# Altium project 通用核心板.PrjPcb
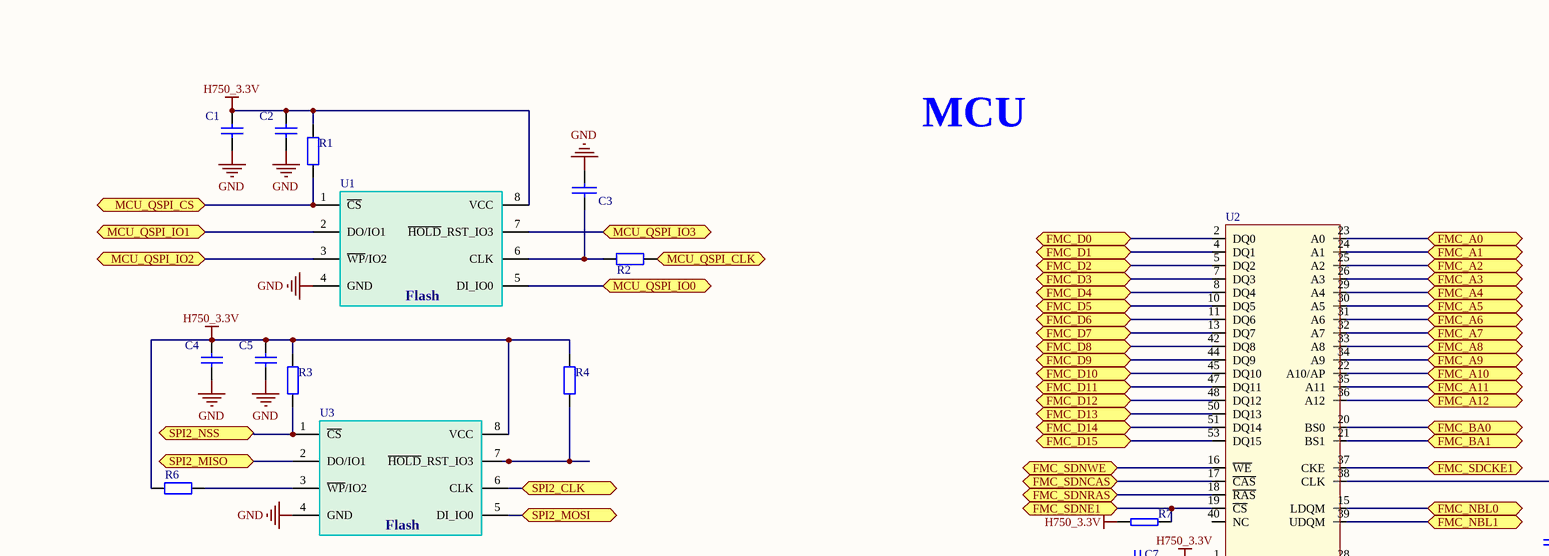
[diagram p0: 通用核心板.SchDoc, top left]
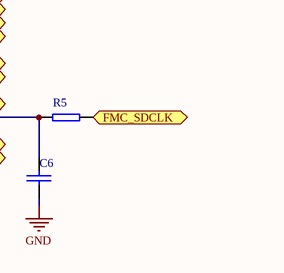
[diagram p1: 通用核心板.SchDoc, top middle]
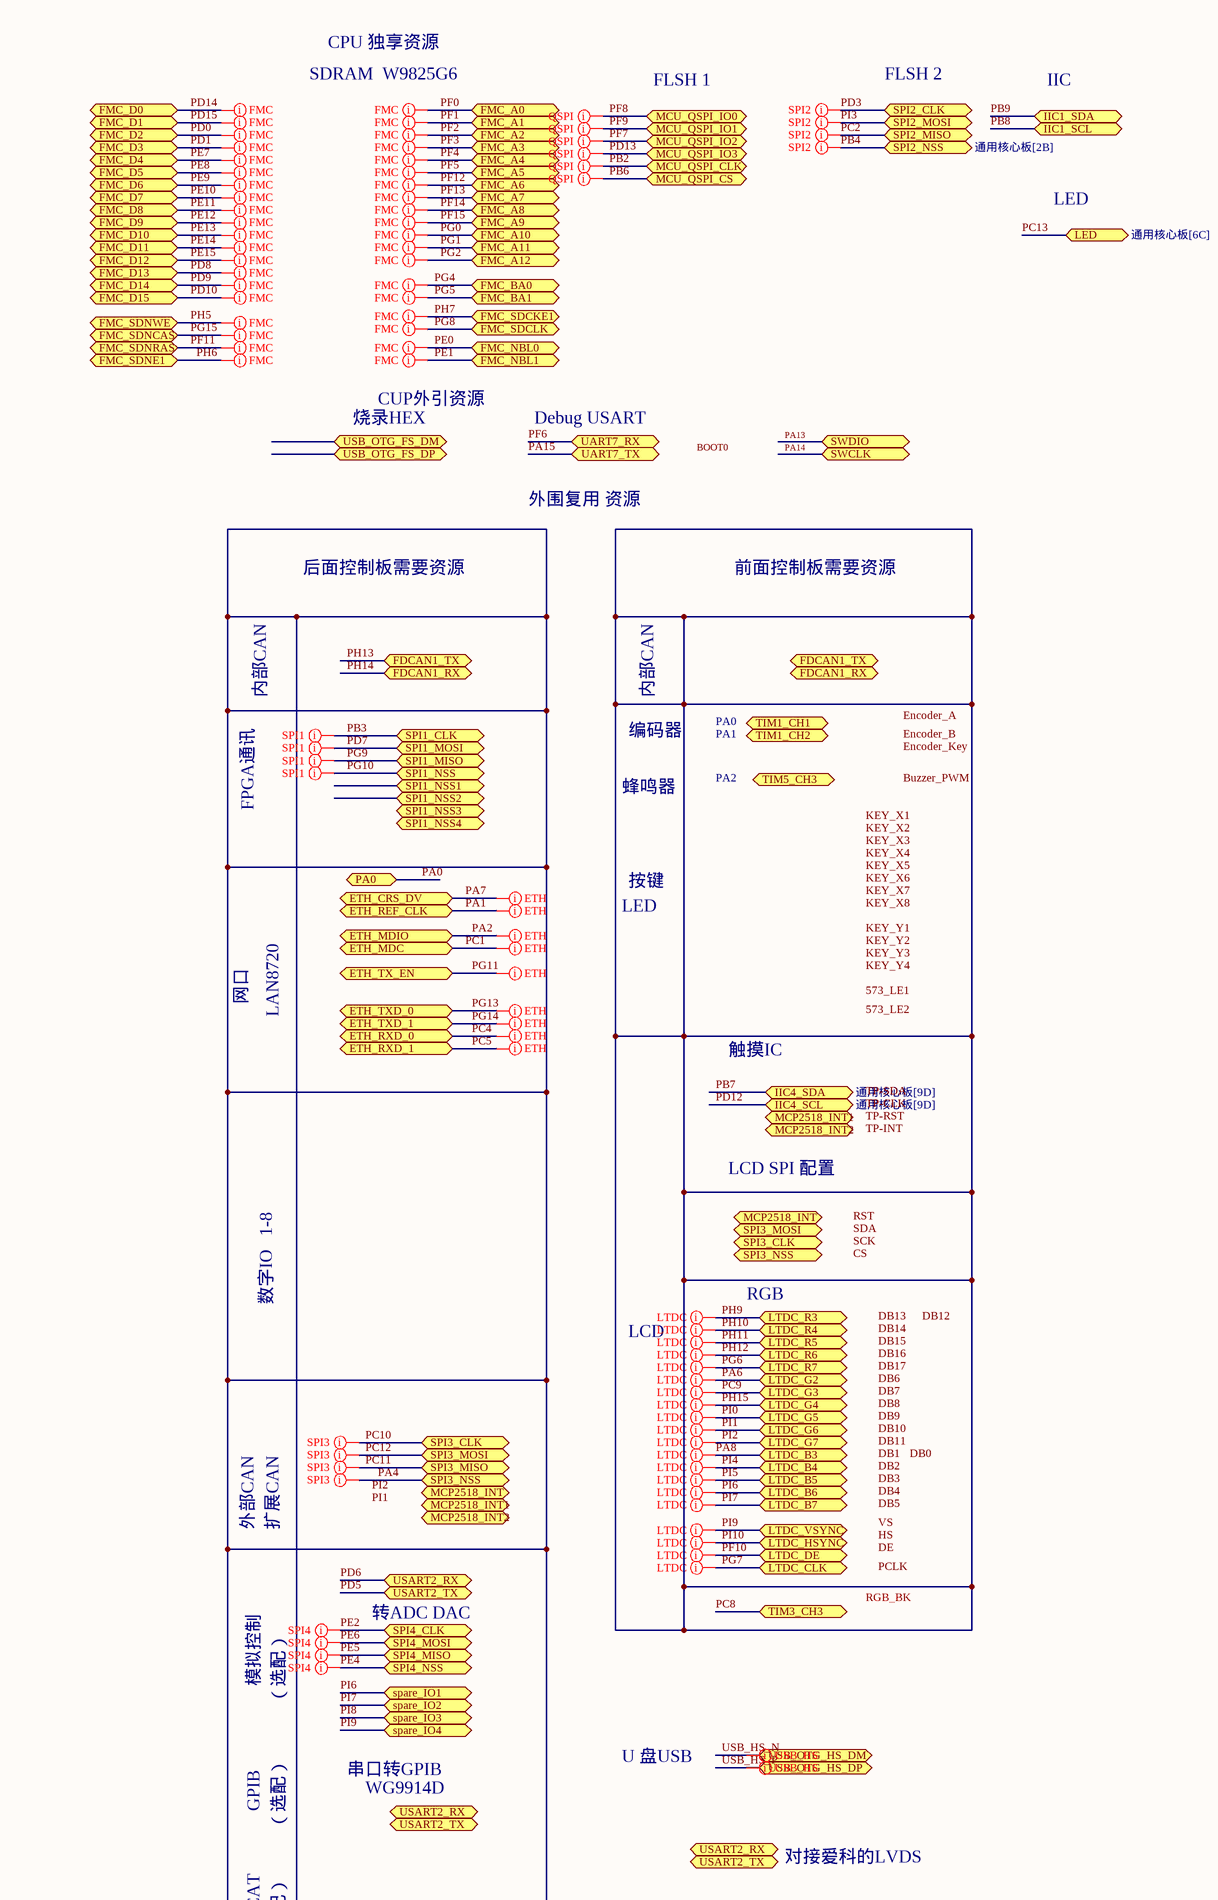
[diagram p2: 通用核心板.SchDoc, top right]
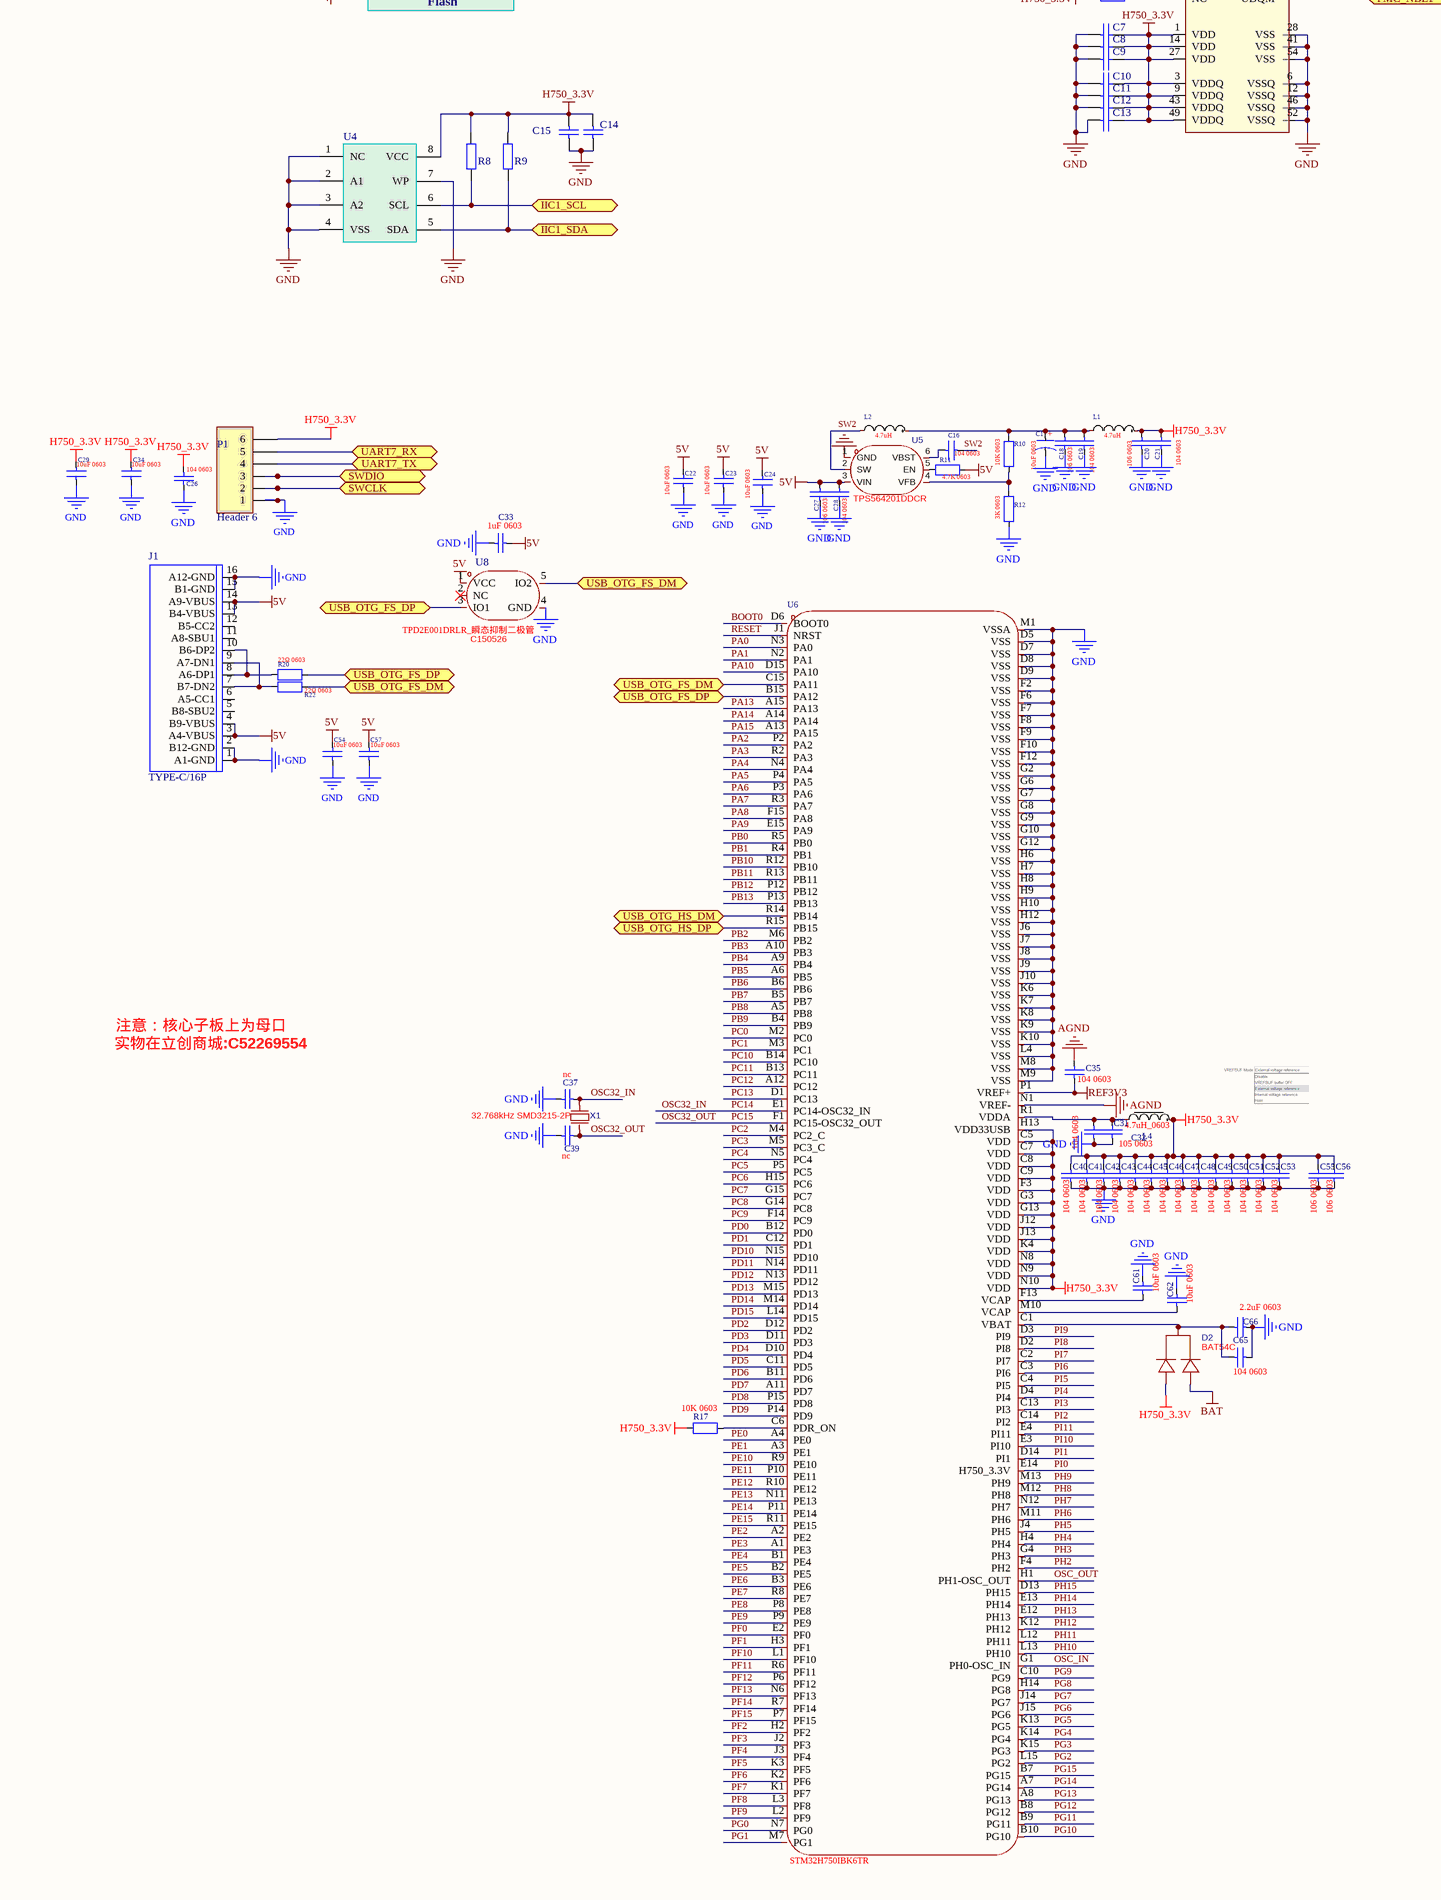
[diagram p3: 通用核心板.SchDoc, bottom left]
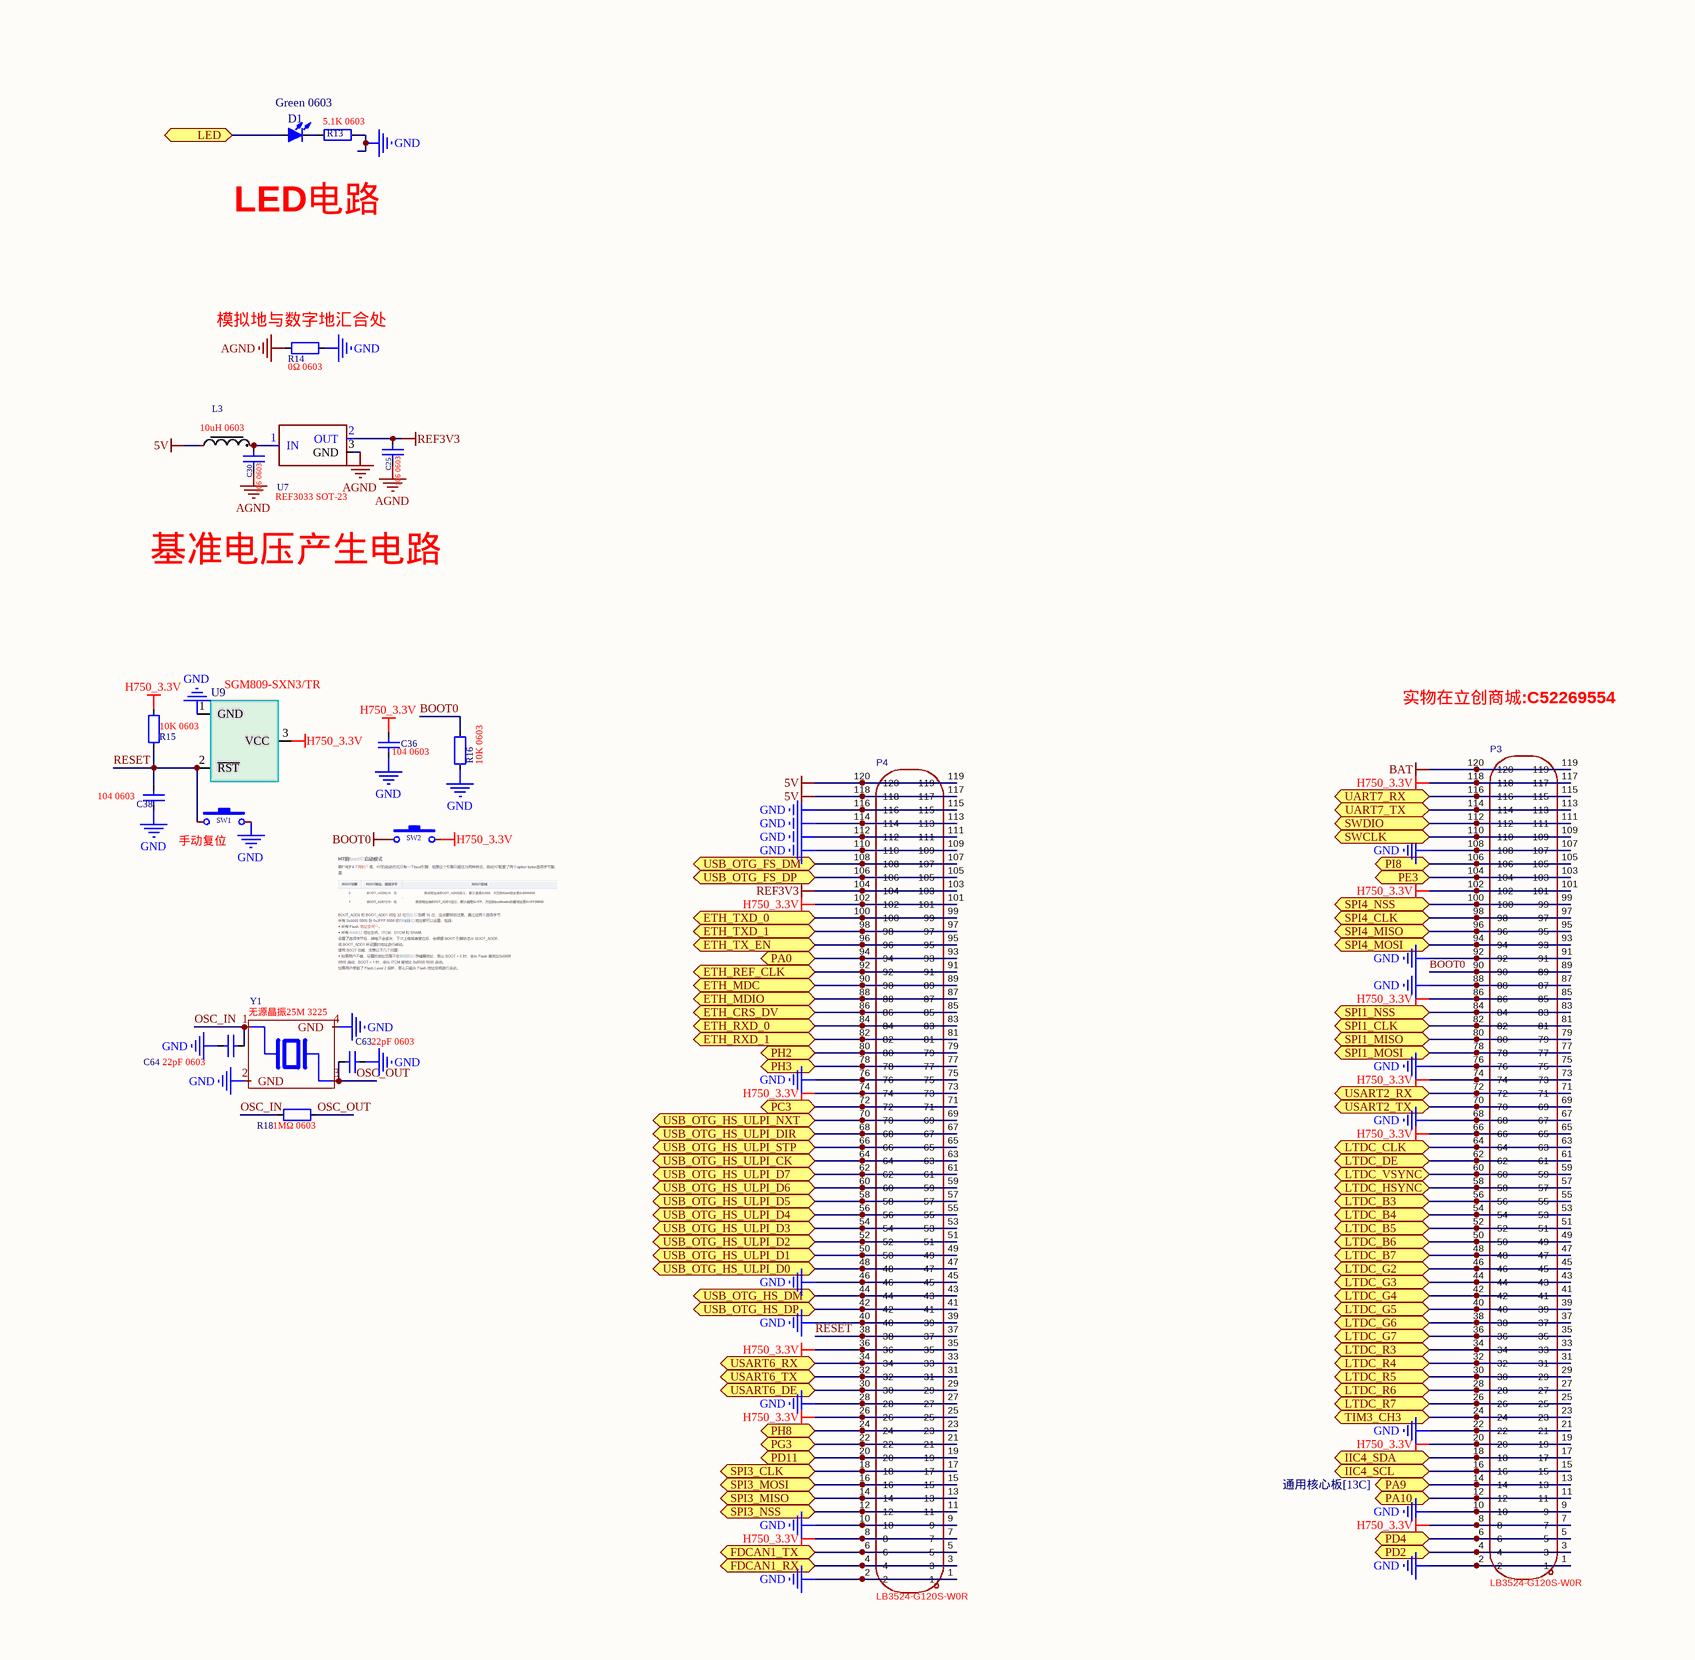
[diagram p4: 通用核心板.SchDoc, bottom middle]
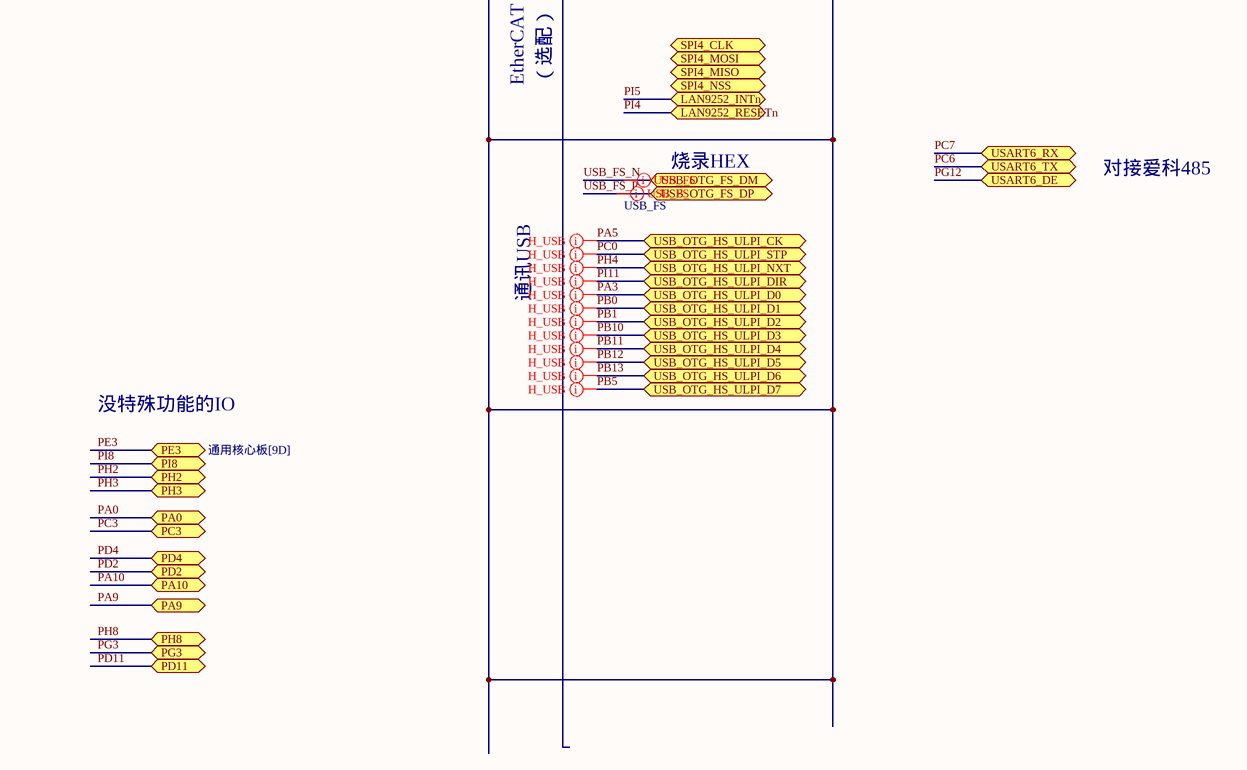
[diagram p5: 通用核心板.SchDoc, bottom right]
1 sheet, 106 parts. Net scope: flat (ports and power ports of the same name join across sheets).
Board file: 通用核心板.PcbDoc

## Sheet 通用核心板.SchDoc
size A0; SheetNumber: 1; SheetTotal: 1

### Parts
C1  贴片独石瓷介电容/106K/±10%/25V/0805/X5R  [C0603]  (value not drawn)
C2  (CZ)贴片电容/贴片/100nF/±5%/50V/0603/X7R/编带  [C0603]  (value not drawn)
C3  18PF/25V  [C0603]  (value not drawn)
C4  贴片独石瓷介电容/106K/±10%/25V/0805/X5R  [C0603]  (value not drawn)
C5  (CZ)贴片电容/贴片/100nF/±5%/50V/0603/X7R/编带  [C0603]  (value not drawn)
C6  NC  [C0603]  (value not drawn)
C7  (CZ)贴片电容/贴片/100nF/±5%/50V/0603/X7R/编带  [C0603]  (value not drawn)
C8  (CZ)贴片电容/贴片/100nF/±5%/50V/0603/X7R/编带  [C0603]  (value not drawn)
C9  (CZ)贴片电容/贴片/100nF/±5%/50V/0603/X7R/编带  [C0603]  (value not drawn)
C10  (CZ)贴片电容/贴片/100nF/±5%/50V/0603/X7R/编带  [C0603]  (value not drawn)
C11  (CZ)贴片电容/贴片/100nF/±5%/50V/0603/X7R/编带  [C0603]  (value not drawn)
C12  (CZ)贴片电容/贴片/100nF/±5%/50V/0603/X7R/编带  [C0603]  (value not drawn)
C13  (CZ)贴片电容/贴片/100nF/±5%/50V/0603/X7R/编带  [C0603]  (value not drawn)
C14  (CZ)贴片电容/贴片/100nF/±5%/50V/0603/X7R/编带  [C0603]  (value not drawn)
C15  贴片独石瓷介电容/106K/±10%/25V/0805/X5R  [C0603]  (value not drawn)
C16  104 0603  [C0603]
C17  10uF 0603  [C0603]
C18  106 0603  [C0603]
C19  104 0603  [C0603]
C20  106 0603  [C0603]
C21  104 0603  [C0603]
C22  10uF 0603  [C0603]
C23  10uF 0603  [C0603]
C24  10uF 0603  [C0603]
C25  106 0603  [C0603]
C26  104 0603  [C0603]
C27  106 0603  [C0603]
C28  104 0603  [C0603]
C29  10uF 0603  [C0603]
C30  106 0603  [C0603]
C31  105 0603  [C0603]
C32  104 0603  [C0603]
C33  1uF 0603  [C0603]
C34  10uF 0603  [C0603]
C35  104 0603  [C0603]
C36  104 0603  [C0603]
C37  nc  [C0603]
C38  104 0603  [C0603]
C39  nc  [C0603]
C40  104 0603  [C0603]
C41  104 0603  [C0603]
C42  104 0603  [C0603]
C43  104 0603  [C0603]
C44  104 0603  [C0603]
C45  104 0603  [C0603]
C46  104 0603  [C0603]
C47  104 0603  [C0603]
C48  104 0603  [C0603]
C49  104 0603  [C0603]
C50  104 0603  [C0603]
C51  104 0603  [C0603]
C52  104 0603  [C0603]
C53  104 0603  [C0603]
C54  10uF 0603  [C0603]
C55  106 0603  [C0603]
C56  106 0603  [C0603]
C57  10uF 0603  [C0603]
C61  10uF 0603  [C0603]
C62  10uF 0603  [C0603]
C63  22pF 0603  [C0603]
C64  22pF 0603  [C0603]
C65  104 0603  [C0603]
C66  2.2uF 0603  [C0603]
D1  Green 0603  [LED_0603]
D2  BAT54C  [BAT54C]
J1  TYPE-C/16P  [TYPE-C/16P]
L1  4.7uH  [L1008]
L2  4.7uH  [L1008]
L3  10uH 0603  [磁珠]
L4  4.7uH_0603  [磁珠]
P1  Header 6  [HDR1X6]
P3  LB3524-G120S-W0R  [LB3524-G120S-W0R]
P4  LB3524-G120S-W0R  [LB3524-G120S-W0R]
R1  贴片电阻Chip Res. 0603 4.7KΩ 1/10W 士1%(RoHS)  [R0603]  (value not drawn)
R2  贴片电阻Chip Res.0603 33Ω  1/16W 土1% 旧编码11279109(RoHS)  [R0603]  (value not drawn)
R3  贴片电阻Chip Res. 0603 4.7KΩ 1/10W 士1%(RoHS)  [R0603]  (value not drawn)
R4  贴片电阻Chip Res. 0603 4.7KΩ 1/10W 士1%(RoHS)  [R0603]  (value not drawn)
R5  33R  [R0603]  (value not drawn)
R6  贴片电阻Chip Res. 0603 4.7KΩ 1/10W 士1%(RoHS)  [R0603]  (value not drawn)
R7  贴片电阻Chip Res. 0603 5.1KΩ 1/10W 士1% 旧编码11277020(RoHS)  [R0603]  (value not drawn)
R8  贴片电阻Chip Res. 0603 2.2KΩ  1/10W 士1% 旧编码11277019(RoHS)  [R0603]  (value not drawn)
R9  贴片电阻Chip Res. 0603 2.2KΩ  1/10W 士1% 旧编码11277019(RoHS)  [R0603]  (value not drawn)
R10  10K 0603  [R0603]
R11  4.7K 0603  [R0603]
R12  3K 0603  [R0603]
R13  5.1K 0603  [R0603]
R14  0Ω 0603  [R0603]
R15  10K 0603  [R0603]
R16  10K 0603  [R0603]
R17  10K 0603  [R0603]
R18  1MΩ 0603  [R0603]
R20  22Ω 0603  [R0603]
R22  22Ω 0603  [R0603]
SW1  SW-PB  [轻触侧按键]  (value not drawn)
SW2  SW-PB  [轻触侧按键]  (value not drawn)
U1  (CD)IC FPGA配置芯片 W25Q64JVSSIQ 封装 SO-8 208mil "Winbond"牌(RoHS)  [MLP-8]  (value not drawn)
U2  (CD)IC/贴片/同步动态随机存取器SDRAM/W9825G6KH-6/TSOPII-54/"Winbond"牌/4M*4banks*16bits  [TSOP-54(L=400MIL)]  (value not drawn)
U3  (CD)IC FPGA配置芯片 W25Q64JVSSIQ 封装 SO-8 208mil "Winbond"牌(RoHS)  [MLP-8]  (value not drawn)
U4  (CD)IC/贴片/铁电存储器/FM24CL64B-GTR/SOIC-8/CYPRESS  [SOP-8]  (value not drawn)
U5  TPS564201DDCR  [TPS564201DDCR]
U6  STM32H750IBK6TR  [STM32H750IBK6TR]
U7  REF3033 SOT-23  [3030]
U8  TPD2E001DRLR_瞬态抑制二极管  [TPD2E001DRLR_瞬态抑制二极管]
U9  SGM809-SXN3/TR  [SGM809-SXN3/TR]
X1  32.768kHz SMD3215-2P  [32.768KHz]
Y1  无源晶振25M 3225  [25M_3225]

### Ports
ETH_CRS_DV (bidir, see 通用核心板[8D]), ETH_CRS_DV (bidir, see 通用核心板[14A]), ETH_MDC (bidir, see 通用核心板[8D]), ETH_MDC (bidir, see 通用核心板[14B]), ETH_MDIO (bidir, see 通用核心板[8D]), ETH_MDIO (bidir, see 通用核心板[14B]), ETH_REF_CLK (bidir, see 通用核心板[8D]), ETH_REF_CLK (bidir, see 通用核心板[14A]), ETH_RXD_0 (bidir, see 通用核心板[8D]), ETH_RXD_0 (bidir, see 通用核心板[14B]), ETH_RXD_1 (bidir, see 通用核心板[8D]), ETH_RXD_1 (bidir, see 通用核心板[14B]), ETH_TX_EN (bidir, see 通用核心板[8D]), ETH_TX_EN (bidir, see 通用核心板[14B]), ETH_TXD_0 (bidir, see 通用核心板[8D]), ETH_TXD_0 (bidir, see 通用核心板[14B]), ETH_TXD_1 (bidir, see 通用核心板[8D]), ETH_TXD_1 (bidir, see 通用核心板[14B]), FDCAN1_RX (bidir, see 通用核心板[8D], 通用核心板[14A]), FDCAN1_RX (bidir, see 通用核心板[8D], 通用核心板[15A]), FDCAN1_RX (bidir, see 通用核心板[14A], 通用核心板[15A]), FDCAN1_TX (bidir, see 通用核心板[8D], 通用核心板[14A]), FDCAN1_TX (bidir, see 通用核心板[8D], 通用核心板[15A]), FDCAN1_TX (bidir, see 通用核心板[14A], 通用核心板[15A]), FMC_A0 (bidir, see 通用核心板[5B]), FMC_A0 (bidir, see 通用核心板[14A]), FMC_A1 (bidir, see 通用核心板[5B]), FMC_A1 (bidir, see 通用核心板[14A]), FMC_A2 (bidir, see 通用核心板[5B]), FMC_A2 (bidir, see 通用核心板[14A]), FMC_A3 (bidir, see 通用核心板[5B]), FMC_A3 (bidir, see 通用核心板[14A]), FMC_A4 (bidir, see 通用核心板[5B]), FMC_A4 (bidir, see 通用核心板[14A]), FMC_A5 (bidir, see 通用核心板[5B]), FMC_A5 (bidir, see 通用核心板[14A]), FMC_A6 (bidir, see 通用核心板[5B]), FMC_A6 (bidir, see 通用核心板[14A]), FMC_A7 (bidir, see 通用核心板[5B]), FMC_A7 (bidir, see 通用核心板[14A]), FMC_A8 (bidir, see 通用核心板[5B]), FMC_A8 (bidir, see 通用核心板[14A]), FMC_A9 (bidir, see 通用核心板[5B]), FMC_A9 (bidir, see 通用核心板[14A]), FMC_A10 (bidir, see 通用核心板[5B]), FMC_A10 (bidir, see 通用核心板[14A]), FMC_A11 (bidir, see 通用核心板[5B]), FMC_A11 (bidir, see 通用核心板[14A]), FMC_A12 (bidir, see 通用核心板[5B]), FMC_A12 (bidir, see 通用核心板[14A]), FMC_BA0 (bidir, see 通用核心板[5B]), FMC_BA0 (bidir, see 通用核心板[14A]), FMC_BA1 (bidir, see 通用核心板[5B]), FMC_BA1 (bidir, see 通用核心板[14A]), FMC_D0 (bidir, see 通用核心板[4B]), FMC_D0 (bidir, see 通用核心板[13A]), FMC_D1 (bidir, see 通用核心板[4B]), FMC_D1 (bidir, see 通用核心板[13A]), FMC_D2 (bidir, see 通用核心板[4B]), FMC_D2 (bidir, see 通用核心板[13A]), FMC_D3 (bidir, see 通用核心板[4B]), FMC_D3 (bidir, see 通用核心板[13A]), FMC_D4 (bidir, see 通用核心板[4B]), FMC_D4 (bidir, see 通用核心板[13A]), FMC_D5 (bidir, see 通用核心板[4B]), FMC_D5 (bidir, see 通用核心板[13A]), FMC_D6 (bidir, see 通用核心板[4B]), FMC_D6 (bidir, see 通用核心板[13A]), FMC_D7 (bidir, see 通用核心板[4B]), FMC_D7 (bidir, see 通用核心板[13A]), FMC_D8 (bidir, see 通用核心板[4B]), FMC_D8 (bidir, see 通用核心板[13A]), FMC_D9 (bidir, see 通用核心板[4B]), FMC_D9 (bidir, see 通用核心板[13A]), FMC_D10 (bidir, see 通用核心板[4B]), FMC_D10 (bidir, see 通用核心板[13A]), FMC_D11 (bidir, see 通用核心板[4B]), FMC_D11 (bidir, see 通用核心板[13A]), FMC_D12 (bidir, see 通用核心板[4B]), FMC_D12 (bidir, see 通用核心板[13A]), FMC_D13 (bidir, see 通用核心板[4B]), FMC_D13 (bidir, see 通用核心板[13A]), FMC_D14 (bidir, see 通用核心板[4B]), FMC_D14 (bidir, see 通用核心板[13A]), FMC_D15 (bidir, see 通用核心板[4B]), FMC_D15 (bidir, see 通用核心板[13A]), FMC_NBL0 (bidir, see 通用核心板[5B]), FMC_NBL0 (bidir, see 通用核心板[14A]), FMC_NBL1 (bidir, see 通用核心板[5B]), FMC_NBL1 (bidir, see 通用核心板[14A]), FMC_SDCKE1 (bidir, see 通用核心板[5B]), FMC_SDCKE1 (bidir, see 通用核心板[14A]), FMC_SDCLK (bidir, see 通用核心板[6B]), FMC_SDCLK (bidir, see 通用核心板[14A]), FMC_SDNCAS (bidir, see 通用核心板[4B]), FMC_SDNCAS (bidir, see 通用核心板[13A]), FMC_SDNE1 (bidir, see 通用核心板[4B]), FMC_SDNE1 (bidir, see 通用核心板[13A]), FMC_SDNRAS (bidir, see 通用核心板[4B]), FMC_SDNRAS (bidir, see 通用核心板[13A]), FMC_SDNWE (bidir, see 通用核心板[4B]), FMC_SDNWE (bidir, see 通用核心板[13A]), IIC1_SCL (bidir, see 通用核心板[3C]), IIC1_SCL (bidir, see 通用核心板[16A]), IIC1_SDA (bidir, see 通用核心板[3C]), IIC1_SDA (bidir, see 通用核心板[16A]), IIC4_SCL (bidir, see 通用核心板[9D]), IIC4_SCL (bidir, see 通用核心板[15B]), IIC4_SDA (bidir, see 通用核心板[9D]), IIC4_SDA (bidir, see 通用核心板[15B]), LAN9252_INTn (bidir), LAN9252_RESETn (bidir), LED (bidir, see 通用核心板[6C]), LED (bidir, see 通用核心板[16A]), LTDC_B3 (bidir, see 通用核心板[9D]), LTDC_B3 (bidir, see 通用核心板[15B]), LTDC_B4 (bidir, see 通用核心板[9D]), LTDC_B4 (bidir, see 通用核心板[15B]), LTDC_B5 (bidir, see 通用核心板[9D]), LTDC_B5 (bidir, see 通用核心板[15B]), LTDC_B6 (bidir, see 通用核心板[9D]), LTDC_B6 (bidir, see 通用核心板[15B]), LTDC_B7 (bidir, see 通用核心板[9D]), LTDC_B7 (bidir, see 通用核心板[15B]), LTDC_CLK (bidir, see 通用核心板[9D]), LTDC_CLK (bidir, see 通用核心板[15B]), LTDC_DE (bidir, see 通用核心板[9D]), LTDC_DE (bidir, see 通用核心板[15B]), LTDC_G2 (bidir, see 通用核心板[9D]), LTDC_G2 (bidir, see 通用核心板[15B]), LTDC_G3 (bidir, see 通用核心板[9D]), LTDC_G3 (bidir, see 通用核心板[15B]), LTDC_G4 (bidir, see 通用核心板[9D]), LTDC_G4 (bidir, see 通用核心板[15B]), LTDC_G5 (bidir, see 通用核心板[9D]), LTDC_G5 (bidir, see 通用核心板[15B]), LTDC_G6 (bidir, see 通用核心板[9D]), LTDC_G6 (bidir, see 通用核心板[15B]), LTDC_G7 (bidir, see 通用核心板[9D]), LTDC_G7 (bidir, see 通用核心板[15B]), LTDC_HSYNC (bidir, see 通用核心板[9D]), LTDC_HSYNC (bidir, see 通用核心板[15B]), LTDC_R3 (bidir, see 通用核心板[9D]), LTDC_R3 (bidir, see 通用核心板[15B]), LTDC_R4 (bidir, see 通用核心板[9D]), LTDC_R4 (bidir, see 通用核心板[15B]), LTDC_R5 (bidir, see 通用核心板[9D]), LTDC_R5 (bidir, see 通用核心板[15B]), LTDC_R6 (bidir, see 通用核心板[9D]), LTDC_R6 (bidir, see 通用核心板[15B]), LTDC_R7 (bidir, see 通用核心板[9D]), LTDC_R7 (bidir, see 通用核心板[15B]), LTDC_VSYNC (bidir, see 通用核心板[9D]), LTDC_VSYNC (bidir, see 通用核心板[15B]), MCP2518_INT1 (bidir, see 通用核心板[14B]), MCP2518_INT1 (bidir, see 通用核心板[15B]), MCP2518_INT2 (bidir, see 通用核心板[14B]), MCP2518_INT2 (bidir, see 通用核心板[15B]), MCP2518_INT (bidir, see 通用核心板[14B]), MCP2518_INT (bidir, see 通用核心板[15B]), MCU_QSPI_CLK (bidir, see 通用核心板[3B]), MCU_QSPI_CLK (bidir, see 通用核心板[15A]), MCU_QSPI_CS (bidir, see 通用核心板[2B]), MCU_QSPI_CS (bidir, see 通用核心板[15A]), MCU_QSPI_IO0 (bidir, see 通用核心板[3B]), MCU_QSPI_IO0 (bidir, see 通用核心板[15A]), MCU_QSPI_IO1 (bidir, see 通用核心板[2B]), MCU_QSPI_IO1 (bidir, see 通用核心板[15A]), MCU_QSPI_IO2 (bidir, see 通用核心板[2B]), MCU_QSPI_IO2 (bidir, see 通用核心板[15A]), MCU_QSPI_IO3 (bidir, see 通用核心板[3B]), MCU_QSPI_IO3 (bidir, see 通用核心板[15A]), PA0 (bidir, see 通用核心板[8D], 通用核心板[13C]), PA0 (bidir, see 通用核心板[8D], 通用核心板[14A]), PA0 (bidir, see 通用核心板[13C], 通用核心板[14A]), PA9 (bidir, see 通用核心板[9D]), PA9 (bidir, see 通用核心板[13C]), PA10 (bidir, see 通用核心板[9D]), PA10 (bidir, see 通用核心板[13C]), PC3 (bidir, see 通用核心板[8D]), PC3 (bidir, see 通用核心板[13C]), PD2 (bidir, see 通用核心板[9D]), PD2 (bidir, see 通用核心板[13C]), PD4 (bidir, see 通用核心板[9D]), PD4 (bidir, see 通用核心板[13C]), PD11 (bidir, see 通用核心板[8D]), PD11 (bidir, see 通用核心板[13C]), PE3 (bidir, see 通用核心板[9D]), PE3 (bidir, see 通用核心板[13C]), PG3 (bidir, see 通用核心板[8D]), PG3 (bidir, see 通用核心板[13C]), PH2 (bidir, see 通用核心板[8D]), PH2 (bidir, see 通用核心板[13C]), PH3 (bidir, see 通用核心板[8D]), PH3 (bidir, see 通用核心板[13C]), PH8 (bidir, see 通用核心板[8D]), PH8 (bidir, see 通用核心板[13C]), PI8 (bidir, see 通用核心板[9D]), PI8 (bidir, see 通用核心板[13C]), spare_IO1 (bidir), spare_IO2 (bidir), spare_IO3 (bidir), spare_IO4 (bidir), SPI1_CLK (bidir, see 通用核心板[9D]), SPI1_CLK (bidir, see 通用核心板[14A]), SPI1_MISO (bidir, see 通用核心板[9D]), SPI1_MISO (bidir, see 通用核心板[14A]), SPI1_MOSI (bidir, see 通用核心板[9D]), SPI1_MOSI (bidir, see 通用核心板[14A]), SPI1_NSS1 (bidir), SPI1_NSS2 (bidir), SPI1_NSS3 (bidir), SPI1_NSS4 (bidir), SPI1_NSS (bidir, see 通用核心板[9D]), SPI1_NSS (bidir, see 通用核心板[14A]), SPI2_CLK (bidir, see 通用核心板[3B]), SPI2_CLK (bidir, see 通用核心板[15A]), SPI2_MISO (bidir, see 通用核心板[2B]), SPI2_MISO (bidir, see 通用核心板[15A]), SPI2_MOSI (bidir, see 通用核心板[3B]), SPI2_MOSI (bidir, see 通用核心板[15A]), SPI2_NSS (bidir, see 通用核心板[2B]), SPI2_NSS (bidir, see 通用核心板[15A]), SPI3_CLK (bidir, see 通用核心板[8D], 通用核心板[14B]), SPI3_CLK (bidir, see 通用核心板[8D], 通用核心板[15B]), SPI3_CLK (bidir, see 通用核心板[14B], 通用核心板[15B]), SPI3_MISO (bidir, see 通用核心板[8D]), SPI3_MISO (bidir, see 通用核心板[14B]), SPI3_MOSI (bidir, see 通用核心板[8D], 通用核心板[14B]), SPI3_MOSI (bidir, see 通用核心板[8D], 通用核心板[15B]), SPI3_MOSI (bidir, see 通用核心板[14B], 通用核心板[15B]), SPI3_NSS (bidir, see 通用核心板[8D], 通用核心板[14B]), SPI3_NSS (bidir, see 通用核心板[8D], 通用核心板[15B]), SPI3_NSS (bidir, see 通用核心板[14B], 通用核心板[15B]), SPI4_CLK (bidir, see 通用核心板[9D], 通用核心板[14B]), SPI4_CLK (bidir, see 通用核心板[14B]), SPI4_MISO (bidir, see 通用核心板[9D], 通用核心板[14B]), SPI4_MISO (bidir, see 通用核心板[9D], 通用核心板[14C]), SPI4_MISO (bidir, see 通用核心板[14B], 通用核心板[14C]), SPI4_MOSI (bidir, see 通用核心板[9D], 通用核心板[14B]), SPI4_MOSI (bidir, see 通用核心板[9D], 通用核心板[14C]), SPI4_MOSI (bidir, see 通用核心板[14B], 通用核心板[14C]), SPI4_NSS (bidir, see 通用核心板[9D], 通用核心板[14B]), SPI4_NSS (bidir, see 通用核心板[9D], 通用核心板[14C]), SPI4_NSS (bidir, see 通用核心板[14B], 通用核心板[14C]), SWCLK (bidir, see 通用核心板[2C], 通用核心板[9D]), SWCLK (bidir, see 通用核心板[2C], 通用核心板[15A]), SWCLK (bidir, see 通用核心板[9D], 通用核心板[15A]), SWDIO (bidir, see 通用核心板[2C], 通用核心板[9D]), SWDIO (bidir, see 通用核心板[2C], 通用核心板[15A]), SWDIO (bidir, see 通用核心板[9D], 通用核心板[15A]), TIM1_CH1 (bidir), TIM1_CH2 (bidir), TIM3_CH3 (bidir, see 通用核心板[9D]), TIM3_CH3 (bidir, see 通用核心板[15B]), TIM5_CH3 (bidir), UART7_RX (bidir, see 通用核心板[2C], 通用核心板[9D]), UART7_RX (bidir, see 通用核心板[2C], 通用核心板[15A]), UART7_RX (bidir, see 通用核心板[9D], 通用核心板[15A]), UART7_TX (bidir, see 通用核心板[2C], 通用核心板[9D]), UART7_TX (bidir, see 通用核心板[2C], 通用核心板[15A]), UART7_TX (bidir, see 通用核心板[9D], 通用核心板[15A]), USART2_RX (bidir, see 通用核心板[9D], 通用核心板[14B]), USART2_RX (bidir, see 通用核心板[9D], 通用核心板[14B], 通用核心板[15B]), USART2_RX (bidir, see 通用核心板[14B], 通用核心板[15B]), USART2_TX (bidir, see 通用核心板[9D], 通用核心板[14B]), USART2_TX (bidir, see 通用核心板[9D], 通用核心板[14B], 通用核心板[15B]), USART2_TX (bidir, see 通用核心板[14B], 通用核心板[15B]), USART6_DE (bidir, see 通用核心板[8D]), USART6_DE (bidir, see 通用核心板[15C]), USART6_RX (bidir, see 通用核心板[8D]), USART6_RX (bidir, see 通用核心板[15C]), USART6_TX (bidir, see 通用核心板[8D]), USART6_TX (bidir, see 通用核心板[15C]), USB_OTG_FS_DM (bidir, see 通用核心板[2C], 通用核心板[3C], 通用核心板[8D], 通用核心板[14A]), USB_OTG_FS_DM (bidir, see 通用核心板[2C], 通用核心板[3C], 通用核心板[8D], 通用核心板[14A], 通用核心板[14C]), USB_OTG_FS_DM (bidir, see 通用核心板[2C], 通用核心板[3C], 通用核心板[8D], 通用核心板[14C]), USB_OTG_FS_DM (bidir, see 通用核心板[2C], 通用核心板[3C], 通用核心板[14A], 通用核心板[14C]), USB_OTG_FS_DM (bidir, see 通用核心板[3C], 通用核心板[8D], 通用核心板[14A], 通用核心板[14C]), USB_OTG_FS_DP (bidir, see 通用核心板[2C], 通用核心板[3C], 通用核心板[8D], 通用核心板[14A]), USB_OTG_FS_DP (bidir, see 通用核心板[2C], 通用核心板[3C], 通用核心板[8D], 通用核心板[14A], 通用核心板[14C]), USB_OTG_FS_DP (bidir, see 通用核心板[2C], 通用核心板[3C], 通用核心板[8D], 通用核心板[14C]), USB_OTG_FS_DP (bidir, see 通用核心板[2C], 通用核心板[3C], 通用核心板[14A], 通用核心板[14C]), USB_OTG_FS_DP (bidir, see 通用核心板[2C], 通用核心板[8D], 通用核心板[14A], 通用核心板[14C]), USB_OTG_HS_DM (bidir, see 通用核心板[3C], 通用核心板[8D]), USB_OTG_HS_DM (bidir, see 通用核心板[3C], 通用核心板[15B]), USB_OTG_HS_DM (bidir, see 通用核心板[8D], 通用核心板[15B]), USB_OTG_HS_DP (bidir, see 通用核心板[3C], 通用核心板[8D]), USB_OTG_HS_DP (bidir, see 通用核心板[3C], 通用核心板[15B]), USB_OTG_HS_DP (bidir, see 通用核心板[8D], 通用核心板[15B]), USB_OTG_HS_ULPI_CK (bidir, see 通用核心板[7D]), USB_OTG_HS_ULPI_CK (bidir, see 通用核心板[14C]), USB_OTG_HS_ULPI_D0 (bidir, see 通用核心板[7D]), USB_OTG_HS_ULPI_D0 (bidir, see 通用核心板[14C]), USB_OTG_HS_ULPI_D1 (bidir, see 通用核心板[7D]), USB_OTG_HS_ULPI_D1 (bidir, see 通用核心板[14C]), USB_OTG_HS_ULPI_D2 (bidir, see 通用核心板[7D]), USB_OTG_HS_ULPI_D2 (bidir, see 通用核心板[14C]), USB_OTG_HS_ULPI_D3 (bidir, see 通用核心板[7D]), USB_OTG_HS_ULPI_D3 (bidir, see 通用核心板[14C]), USB_OTG_HS_ULPI_D4 (bidir, see 通用核心板[7D]), USB_OTG_HS_ULPI_D4 (bidir, see 通用核心板[14C]), USB_OTG_HS_ULPI_D5 (bidir, see 通用核心板[7D]), USB_OTG_HS_ULPI_D5 (bidir, see 通用核心板[14C]), USB_OTG_HS_ULPI_D6 (bidir, see 通用核心板[7D]), USB_OTG_HS_ULPI_D6 (bidir, see 通用核心板[14C]), USB_OTG_HS_ULPI_D7 (bidir, see 通用核心板[7D]), USB_OTG_HS_ULPI_D7 (bidir, see 通用核心板[14C]), USB_OTG_HS_ULPI_DIR (bidir, see 通用核心板[7D]), USB_OTG_HS_ULPI_DIR (bidir, see 通用核心板[14C]), USB_OTG_HS_ULPI_NXT (bidir, see 通用核心板[7D]), USB_OTG_HS_ULPI_NXT (bidir, see 通用核心板[14C]), USB_OTG_HS_ULPI_STP (bidir, see 通用核心板[7D]), USB_OTG_HS_ULPI_STP (bidir, see 通用核心板[14C])

### Nets
5V: C22.1 C23.1 C24.1 C27.1 C28.1 C33.2 C54.1 C57.1 J1.3(A4-VBUS) J1.4(B9-VBUS) J1.13(B4-VBUS) J1.14(A9-VBUS) L3.1 P4.117 P4.118 P4.119 P4.120 R11.2 U5.3(VIN) U8.1(VCC)
AGND: C25.2 C30.2 C35.2 R14.2 U6.N1(VREF-) U7.3(GND)
BAT: D2.1(A1) P3.119 P3.120
BOOT0: P3.89 P3.90 R16.2 SW2.1 U6.D6(BOOT0)
GND: C1.1 C2.1 C3.1 C4.1 C5.1 C6.2 C7.1 C8.1 C9.1 C10.1 C11.1 C12.1 C13.1 C14.2 C15.2 C17.2(K) C18.2 C19.2 C20.2 C21.2 C22.2 C23.2 C24.2 C26.2 C27.2 C28.2 C29.2 C31.2 C32.1 C33.1 C34.2 C36.1 C37.2 C38.1 C39.2 C40.2 C41.2 C42.2 C43.2 C44.2 C45.2 C46.2 C47.2 C48.2 C49.2 C50.2 C51.2 C52.2 C53.2 C54.2 C55.2 C56.2 C57.2 C61.2 C62.2 C63.2 C64.2 C65.1 C66.2 J1.1(A1-GND) J1.2(B12-GND) J1.15(B1-GND) J1.16(A12-GND) P1.1 P3.1 P3.2 P3.9 P3.10 P3.21 P3.22 P3.67 P3.68 P3.75 P3.76 P3.87 P3.88 P3.91 P3.92 P3.107 P3.108 P4.1 P4.2 P4.9 P4.10 P4.27 P4.28 P4.39 P4.40 P4.45 P4.46 P4.75 P4.76 P4.109 P4.110 P4.111 P4.112 P4.113 P4.114 P4.115 P4.116 R12.1 R13.1 R14.1 R16.1 SW1.2 U1.4(GND) U2.6(VSSQ) U2.12(VSSQ) U2.28(VSS) U2.41(VSS) U2.46(VSSQ) U2.52(VSSQ) U2.54(VSS) U3.4(GND) U4.1(NC) U4.2(A1) U4.3(A2) U4.4(VSS) U4.7(WP) U5.1(GND) U6.D5(VSS) U6.D7(VSS) U6.D8(VSS) U6.D9(VSS) U6.F2(VSS) U6.F6(VSS) U6.F7(VSS) U6.F8(VSS) U6.F9(VSS) U6.F10(VSS) U6.F12(VSS) U6.G2(VSS) U6.G6(VSS) U6.G7(VSS) U6.G8(VSS) U6.G9(VSS) U6.G10(VSS) U6.G12(VSS) U6.H6(VSS) U6.H7(VSS) U6.H8(VSS) U6.H9(VSS) U6.H10(VSS) U6.H12(VSS) U6.J6(VSS) U6.J7(VSS) U6.J8(VSS) U6.J9(VSS) U6.J10(VSS) U6.K6(VSS) U6.K7(VSS) U6.K8(VSS) U6.K9(VSS) U6.K10(VSS) U6.L4(VSS) U6.M1(VSSA) U6.M8(VSS) U6.M9(VSS) U8.4(GND) U9.1(GND) Y1.2(GND) Y1.4(GND)
H750_3.3V: C1.2 C2.2 C4.2 C5.2 C7.2 C8.2 C9.2 C10.2 C11.2 C12.2 C13.2 C14.1 C15.1 C20.1 C21.1 C26.1 C29.1 C34.1 C36.2 C40.1 C41.1 C42.1 C43.1 C44.1 C45.1 C46.1 C47.1 C48.1 C49.1 C50.1 C51.1 C52.1 C53.1 C55.1 C56.1 D2.2(A2) L1.2 L4.2 P1.6 P3.7 P3.8 P3.19 P3.20 P3.65 P3.66 P3.73 P3.74 P3.85 P3.86 P3.101 P3.102 P3.117 P3.118 P4.7 P4.8 P4.25 P4.26 P4.35 P4.36 P4.73 P4.74 P4.101 P4.102 R1.2 R3.2 R4.2 R6.2 R7.2 R8.1 R9.1 R15.2 R17.2 SW2.2 U1.8(VCC) U2.1(VDD) U2.3(VDDQ) U2.9(VDDQ) U2.14(VDD) U2.27(VDD) U2.43(VDDQ) U2.49(VDDQ) U3.8(VCC) U4.8(VCC) U6.C5(VDD) U6.C7(VDD) U6.C8(VDD) U6.C9(VDD) U6.F3(VDD) U6.G3(VDD) U6.G13(VDD) U6.H13(VDD33USB) U6.J12(VDD) U6.J13(VDD) U6.K4(VDD) U6.N8(VDD) U6.N9(VDD) U6.N10(VDD) U9.3(VCC)
REF3V3: C25.1 C35.1 P4.103 P4.104 U6.P1(VREF+) U7.2(OUT)
OSC32_IN: C37.1 U6.E1(PC14-OSC32_IN) X1.2(OSC2)  [also labelled PC14]
OSC32_OUT: C39.1 U6.F1(PC15-OSC32_OUT) X1.1(OSC1)  [also labelled PC15]
OSC_IN: C64.1 R18.2 U6.G1(PH0-OSC_IN) Y1.1
OSC_OUT: C63.1 R18.1 U6.H1(PH1-OSC_OUT) Y1.3
PA0: P4.93 P4.94 U6.N3(PA0) ; port PA0
PA1: P4.91 P4.92 U6.N2(PA1) ; port ETH_REF_CLK
PA2: P4.87 P4.88 U6.P2(PA2) ; port ETH_MDIO
PA3: P4.47 P4.48 U6.R2(PA3) ; port USB_OTG_HS_ULPI_D0
PA4: P4.11 P4.12 U6.N4(PA4) ; port SPI3_NSS
PA5: P4.63 P4.64 U6.P4(PA5) ; port USB_OTG_HS_ULPI_CK
PA6: P3.45 P3.46 U6.P3(PA6) ; port LTDC_G2
PA7: P4.85 P4.86 U6.R3(PA7) ; port ETH_CRS_DV
PA8: P3.55 P3.56 U6.F15(PA8) ; port LTDC_B3
PA9: P3.13 P3.14 U6.E15(PA9) ; port PA9
PA10: P3.11 P3.12 U6.D15(PA10) ; port PA10
PA13: P1.3 P3.111 P3.112 U6.A15(PA13) ; port SWDIO
PA14: P1.2 P3.109 P3.110 U6.A14(PA14) ; port SWCLK
PA15: P1.4 P3.113 P3.114 U6.A13(PA15) ; port UART7_TX
PB0: P4.49 P4.50 U6.R5(PB0) ; port USB_OTG_HS_ULPI_D1
PB1: P4.51 P4.52 U6.R4(PB1) ; port USB_OTG_HS_ULPI_D2
PB2: R2.2 U6.M6(PB2) ; port MCU_QSPI_CLK
PB3: P3.81 P3.82 U6.A10(PB3) ; port SPI1_CLK
PB4: R3.1 U3.1(~{CS}) U6.A9(PB4) ; port SPI2_NSS
PB5: P4.61 P4.62 U6.A6(PB5) ; port USB_OTG_HS_ULPI_D7
PB6: R1.1 U1.1(~{CS}) U6.B6(PB6) ; port MCU_QSPI_CS
PB7: P3.17 P3.18 U6.B5(PB7) ; port IIC4_SDA
PB8: R8.2 U4.6(SCL) U6.A5(PB8) ; port IIC1_SCL
PB9: R9.2 U4.5(SDA) U6.B4(PB9) ; port IIC1_SDA
PB10: P4.53 P4.54 U6.R12(PB10) ; port USB_OTG_HS_ULPI_D3
PB11: P4.55 P4.56 U6.R13(PB11) ; port USB_OTG_HS_ULPI_D4
PB12: P4.57 P4.58 U6.P12(PB12) ; port USB_OTG_HS_ULPI_D5
PB13: P4.59 P4.60 U6.P13(PB13) ; port USB_OTG_HS_ULPI_D6
PC0: P4.65 P4.66 U6.M2(PC0) ; port USB_OTG_HS_ULPI_STP
PC1: P4.89 P4.90 U6.M3(PC1) ; port ETH_MDC
PC2: U3.2(DO/IO1) U6.M4(PC2_C) ; port SPI2_MISO
PC3: P4.71 P4.72 U6.M5(PC3_C) ; port PC3
PC4: P4.83 P4.84 U6.N5(PC4) ; port ETH_RXD_0
PC5: P4.81 P4.82 U6.P5(PC5) ; port ETH_RXD_1
PC6: P4.31 P4.32 U6.H15(PC6) ; port USART6_TX
PC7: P4.33 P4.34 U6.G15(PC7) ; port USART6_RX
PC8: P3.23 P3.24 U6.G14(PC8) ; port TIM3_CH3
PC9: P3.43 P3.44 U6.F14(PC9) ; port LTDC_G3
PC10: P4.17 P4.18 U6.B14(PC10) ; port SPI3_CLK
PC11: P4.13 P4.14 U6.B13(PC11) ; port SPI3_MISO
PC12: P4.15 P4.16 U6.A12(PC12) ; port SPI3_MOSI
PC13: D1.1(A) U6.D1(PC13) ; port LED
PD0: U2.5(DQ2) U6.B12(PD0) ; port FMC_D2
PD1: U2.7(DQ3) U6.C12(PD1) ; port FMC_D3
PD2: P3.3 P3.4 U6.D12(PD2) ; port PD2
PD3: U3.6(CLK) U6.D11(PD3) ; port SPI2_CLK
PD4: P3.5 P3.6 U6.D10(PD4) ; port PD4
PD5: P3.69 P3.70 U6.C11(PD5) ; port USART2_TX
PD6: P3.71 P3.72 U6.B11(PD6) ; port USART2_RX
PD7: P3.77 P3.78 U6.A11(PD7) ; port SPI1_MOSI
PD8: U2.50(DQ13) U6.P15(PD8) ; port FMC_D13
PD9: U2.51(DQ14) U6.P14(PD9) ; port FMC_D14
PD10: U2.53(DQ15) U6.N15(PD10) ; port FMC_D15
PD11: P4.19 P4.20 U6.N14(PD11) ; port PD11
PD12: P3.15 P3.16 U6.N13(PD12) ; port IIC4_SCL
PD13: U1.7(~{HOLD}_RST_IO3) U6.M15(PD13) ; port MCU_QSPI_IO3
PD14: U2.2(DQ0) U6.M14(PD14) ; port FMC_D0
PD15: U2.4(DQ1) U6.L14(PD15) ; port FMC_D1
PE0: U2.15(LDQM) U6.A4(PE0) ; port FMC_NBL0
PE1: U2.39(UDQM) U6.A3(PE1) ; port FMC_NBL1
PE2: P3.97 P3.98 U6.A2(PE2) ; port SPI4_CLK
PE3: P3.103 P3.104 U6.A1(PE3) ; port PE3
PE4: P3.99 P3.100 U6.B1(PE4) ; port SPI4_NSS
PE5: P3.95 P3.96 U6.B2(PE5) ; port SPI4_MISO
PE6: P3.93 P3.94 U6.B3(PE6) ; port SPI4_MOSI
PE7: U2.8(DQ4) U6.R8(PE7) ; port FMC_D4
PE8: U2.10(DQ5) U6.P8(PE8) ; port FMC_D5
PE9: U2.11(DQ6) U6.P9(PE9) ; port FMC_D6
PE10: U2.13(DQ7) U6.R9(PE10) ; port FMC_D7
PE11: U2.42(DQ8) U6.P10(PE11) ; port FMC_D8
PE12: U2.44(DQ9) U6.R10(PE12) ; port FMC_D9
PE13: U2.45(DQ10) U6.N11(PE13) ; port FMC_D10
PE14: U2.47(DQ11) U6.P11(PE14) ; port FMC_D11
PE15: U2.48(DQ12) U6.R11(PE15) ; port FMC_D12
PF0: U2.23(A0) U6.E2(PF0) ; port FMC_A0
PF1: U2.24(A1) U6.H3(PF1) ; port FMC_A1
PF2: U2.25(A2) U6.H2(PF2) ; port FMC_A2
PF3: U2.26(A3) U6.J2(PF3) ; port FMC_A3
PF4: U2.29(A4) U6.J3(PF4) ; port FMC_A4
PF5: U2.30(A5) U6.K3(PF5) ; port FMC_A5
PF6: P1.5 P3.115 P3.116 U6.K2(PF6) ; port UART7_RX
PF7: U1.3(~{WP}/IO2) U6.K1(PF7) ; port MCU_QSPI_IO2
PF8: U1.5(DI_IO0) U6.L3(PF8) ; port MCU_QSPI_IO0
PF9: U1.2(DO/IO1) U6.L2(PF9) ; port MCU_QSPI_IO1
PF10: P3.61 P3.62 U6.L1(PF10) ; port LTDC_DE
PF11: U2.18(~{RAS}) U6.R6(PF11) ; port FMC_SDNRAS
PF12: U2.31(A6) U6.P6(PF12) ; port FMC_A6
PF13: U2.32(A7) U6.N6(PF13) ; port FMC_A7
PF14: U2.33(A8) U6.R7(PF14) ; port FMC_A8
PF15: U2.34(A9) U6.P7(PF15) ; port FMC_A9
PG0: U2.22(A10/AP) U6.N7(PG0) ; port FMC_A10
PG1: U2.35(A11) U6.M7(PG1) ; port FMC_A11
PG2: U2.36(A12) U6.L15(PG2) ; port FMC_A12
PG3: P4.21 P4.22 U6.K15(PG3) ; port PG3
PG4: U2.20(BS0) U6.K14(PG4) ; port FMC_BA0
PG5: U2.21(BS1) U6.K13(PG5) ; port FMC_BA1
PG6: P3.25 P3.26 U6.J15(PG6) ; port LTDC_R7
PG7: P3.63 P3.64 U6.J14(PG7) ; port LTDC_CLK
PG8: R5.2 U6.H14(PG8) ; port FMC_SDCLK
PG9: P3.79 P3.80 U6.C10(PG9) ; port SPI1_MISO
PG10: P3.83 P3.84 U6.B10(PG10) ; port SPI1_NSS
PG11: P4.95 P4.96 U6.B9(PG11) ; port ETH_TX_EN
PG12: P4.29 P4.30 U6.B8(PG12) ; port USART6_DE
PG13: P4.99 P4.100 U6.A8(PG13) ; port ETH_TXD_0
PG14: P4.97 P4.98 U6.A7(PG14) ; port ETH_TXD_1
PG15: U2.17(~{CAS}) U6.B7(PG15) ; port FMC_SDNCAS
PH2: P4.79 P4.80 U6.F4(PH2) ; port PH2
PH3: P4.77 P4.78 U6.G4(PH3) ; port PH3
PH4: P4.69 P4.70 U6.H4(PH4) ; port USB_OTG_HS_ULPI_NXT
PH5: U2.16(~{WE}) U6.J4(PH5) ; port FMC_SDNWE
PH6: R7.1 U2.19(~{CS}) U6.M11(PH6) ; port FMC_SDNE1
PH7: U2.37(CKE) U6.N12(PH7) ; port FMC_SDCKE1
PH8: P4.23 P4.24 U6.M12(PH8) ; port PH8
PH9: P3.33 P3.34 U6.M13(PH9) ; port LTDC_R3
PH10: P3.31 P3.32 U6.L13(PH10) ; port LTDC_R4
PH11: P3.29 P3.30 U6.L12(PH11) ; port LTDC_R5
PH12: P3.27 P3.28 U6.K12(PH12) ; port LTDC_R6
PH13: P4.5 P4.6 U6.E12(PH13) ; port FDCAN1_TX
PH14: P4.3 P4.4 U6.E13(PH14) ; port FDCAN1_RX
PH15: P3.41 P3.42 U6.D13(PH15) ; port LTDC_G4
PI0: P3.39 P3.40 U6.E14(H750_3.3V) ; port LTDC_G5
PI1: P3.37 P3.38 U6.D14(PI1) ; port LTDC_G6
PI2: P3.35 P3.36 U6.C14(PI2) ; port LTDC_G7
PI3: U3.5(DI_IO0) U6.C13(PI3) ; port SPI2_MOSI
PI4: P3.53 P3.54 U6.D4(PI4) ; port LTDC_B4, port LAN9252_RESETn
PI5: P3.51 P3.52 U6.C4(PI5) ; port LTDC_B5, port LAN9252_INTn
PI6: P3.49 P3.50 U6.C3(PI6) ; port LTDC_B6, port spare_IO1
PI7: P3.47 P3.48 U6.C2(PI7) ; port LTDC_B7, port spare_IO2
PI8: P3.105 P3.106 U6.D2(PI8) ; port spare_IO3, port PI8
PI9: P3.59 P3.60 U6.D3(PI9) ; port LTDC_VSYNC, port spare_IO4
PI10: P3.57 P3.58 U6.E3(PI10) ; port LTDC_HSYNC
PI11: P4.67 P4.68 U6.E4(PI11) ; port USB_OTG_HS_ULPI_DIR
RESET: C38.2 P4.37 P4.38 R15.1 SW1.1 U6.J1(NRST) U9.2(~{RST})
SW2: C16.1 L2.1 U5.2(SW)
USB_FS_N: P4.107 P4.108 R22.1 U6.C15(PA11) U8.5(IO2) ; port USB_OTG_FS_DM
USB_FS_P: P4.105 P4.106 R20.1 U6.B15(PA12) U8.3(IO1) ; port USB_OTG_FS_DP
USB_HS_N: P4.43 P4.44 U6.R14(PB14) ; port USB_OTG_HS_DM
USB_HS_P: P4.41 P4.42 U6.R15(PB15) ; port USB_OTG_HS_DP
NetC3_2: C3.2 R2.1 U1.6(CLK)
NetC6_1: C6.1 R5.1 U2.38(CLK)
NetC16_2: C16.2 U5.6(VBST)
NetC17_1: C17.1(A) C18.1 C19.1 L1.1 L2.2 R10.1
NetC30_1: C30.1 L3.2 U7.1(IN)
NetC31_1: C31.1 C32.2 L4.1 U6.R1(VDDA)
NetC61_1: C61.1 U6.F13(VCAP)
NetC62_1: C62.1 U6.M10(VCAP)
NetC65_2: C65.2 C66.1 D2.3(K) U6.C1(VBAT)
NetD1_2: D1.2(K) R13.2
NetJ1_7: J1.7(B7-DN2) J1.9(A7-DN1) R22.2
NetJ1_8: J1.8(A6-DP1) J1.10(B6-DP2) R20.2
NetR4_1: R4.1 U3.7(~{HOLD}_RST_IO3)
NetR6_1: R6.1 U3.3(~{WP}/IO2)
NetR10_2: R10.2 R12.2 U5.4(VFB)
NetR11_1: R11.1 U5.5(EN)
NetR17_1: R17.1 U6.C6(PDR_ON)

Not connected (* = marked no-connect by the designer): J1 5(B8-SBU2) 6(A5-CC1) 11(A8-SBU1) 12(B5-CC2); U2 40(NC); U8 2(NC)*

### Layout directives
net class FMC: PD0, PD1, PD8, PD9, PD10, PD14, PD15, PE0, PE1, PE7, PE8, PE9, PE10, PE11, PE12, PE13, PE14, PE15, PF0, PF1, PF2, PF3, PF4, PF5, PF11, PF12, PF13, PF14, PF15, PG0, PG1, PG2, PG4, PG5, PG8, PG15, PH5, PH6, PH7
net class ETH: PA1, PA2, PA7, PC1, PC4, PC5, PG11, PG13, PG14
net class SPI1: PB3, PD7, PG9, PG10
net class SPI3: PA4, PC10, PC11, PC12
net class H_USB: PA3, PA5, PB0, PB1, PB5, PB10, PB11, PB12, PB13, PC0, PH4, PI11
differential pair; net class USB_FS: USB_FS_N, USB_FS_P
differential pair; net class USB_HS: USB_HS_N, USB_HS_P
net class SPI4: PE2, PE4, PE5, PE6
net class LTDC: PA6, PA8, PC9, PF10, PG6, PG7, PH9, PH10, PH11, PH12, PH15, PI0, PI1, PI2, PI4, PI5, PI6, PI7, PI9, PI10
net class QSPI: PB2, PB6, PD13, PF7, PF8, PF9
net class SPI2: PB4, PC2, PD3, PI3

### Notes on the sheet
- SDRAM  W9825G6
- CPU 独享资源
- FLSH 1
- FLSH 2
- IIC
- LED
- CUP外引资源
- 烧录HEX
- Debug USART
- 外围复用 资源
- 后面控制板需要资源
- 前面控制板需要资源
- 内部CAN
- 编码器
- PA2
- PA1
- PA0
- FPGA通讯
- 蜂鸣器
- 按键
- 网口
- LAN8720
- 触摸IC
- LCD SPI 配置
- 数字IO   1-8
- LCD
- RGB
- MCU
- 外部CAN
- 扩展CAN
- (near U1) Flash
- 转ADC DAC
- 模拟控制
- （选配）
- (near U3) Flash
- 串口转GPIB
- U 盘USB
- GPIB
- WG9914D
- 对接爱科的LVDS
- EtherCAT
- 对接爱科485
- 通讯USB
- 没特殊功能的IO
- LED电路
- (near U8) C150526
- (near R14) 模拟地与数字地汇合处
- 基准电压产生电路
- 注意：核心子板上为母口
- 实物在立创商城:C52269554
- (near SW1) 手动复位
- Labels drawn without touching a wire or pin: 573_LE1, 573_LE2, BOOT0, Buzzer_PWM, CS, DB0, DB1, DB2, DB3, DB4, DB5, DB6, DB7, DB8, DB9, DB10, DB11, DB12, DB13, DB14, DB15, DB16, DB17, DE, Encoder_A, Encoder_B, Encoder_Key, HS, KEY_X1, KEY_X2, KEY_X3, KEY_X4, KEY_X5, KEY_X6, KEY_X7, KEY_X8, KEY_Y1, KEY_Y2, KEY_Y3, KEY_Y4, PCLK, PI1, PI2, RGB_BK, RST, SCK, SDA, TP-CLK, TP-INT, TP-RST, TP-SDA, VS
- (in symbol C_0CAP+) +

### Library data of the parts
C1 C4 C15 = Cap: 电容; 编号: 110101700384X; 名称: 贴片独石瓷介电容/106K/±10%/25V/0805/X5R
C2 C5 C14 = Cap: 电容; 编号: 110101701033X; 名称: (CZ)贴片电容/贴片/100nF/±5%/50V/0603/X7R/编带
C3 C6 = 1uF 0603 50V: 贴片电容
C7-C13 = 100nF 0603 50V: 贴片电容; 编号: 110101701033X; 名称: (CZ)贴片电容/贴片/100nF/±5%/50V/0603/X7R/编带
C16 C18-C30 C33 C34 C36-C39 C54 C57 C63-C65 = C_0603: 无极性贴片电容_0603
C17 = C_0CAP+: 贴片钽电容
C31 C32 C35 C40-C53 C55 C56 C61 C62 C66 = C_0603: C309062
D1 = D_0603_LED: 发光二极管_0603封装
D2 = BAT54C_C2135: 二极管配置:-;正向压降(Vf):1V@100mA;直流反向耐压(Vr):30V;整流电流:200mA;; Manufacturer: CJ(江苏长电/长晶); AddInBom: yes; ModelId: 89cb27a44ab2466697082bb9fd73a7d0聨0819f05c4eef4c71ace90d822a990e87; ModelName: SOT-23-3L_L2.9-W1.6-H1.1-LS2.8-P0.95; ModelTransform: 114.173,110.236,0,90,0,0,0,0,0; Voltage - DC Reverse(Vr): 30V; Current - Rectified: 200mA; Reverse Leakage Current (Ir): 2uA@25V; Non-Repetitive Peak Forward Surge Current: 600mA; Symbol: BAT54C; Device: BAT54C_C2135; LCSC Part Name: 电压:30V 电流:200mA; SupplierPart: C2135; ManufacturerPart: BAT54C; Supplier Footprint: SOT-23; JLCPCB Part Class: Extended Part; Datasheet: https://item.szlcsc.com/datasheet/BAT54C/2492.html; Supplier: LCSC; ConvertToPcb: yes; FootprintName: SOT-23-3_L2.9-W1.6-P1.90-LS2.8-BR; Diode Configuration: -; Voltage - Forward(Vf@If): 1V@100mA
L1 L2 = L: 110103200466X
L3 L4 = L_0603: 磁珠; Manufacturer: PANASONIC(松下); Symbol: ETQP3M100KVN; Add into BOM: yes; Tolerance: ±20%; Rated Current: 2.9A; DC Resistance (DCR): 71mΩ; Name: =Value; Device: ETQP3M100KVN; LCSC Part Name: 10uH ±20% 2.9A 71mΩ; Supplier Part: C409618; Manufacturer Part: ETQP3M100KVN; Supplier Footprint: SMD; JLCPCB Part Class: 扩展库; Datasheet: https://atta.szlcsc.com/upload/public/pdf/source/20190806/C409618_731F4B067570C25983EEEAB1929CC21D.pdf; Supplier: LCSC; Convert to PCB: yes
P1 = Header 6: Header, 6-Pin; LatestRevisionDate: 17-Jul-2002; LatestRevisionNote: Re-released for DXP Platform.; Publisher: Altium Limited
P3 P4 = LB3524-G120S-W0R: C52269554; Manufacturer: LXWCONN(连兴旺电子); AddInBom: yes; ModelId: e02649df5b1f465eb7b50ca5d05849a8聨0819f05c4eef4c71ace90d822a990e87; ModelName: CONN-SMD_LB3524-G120S-W0R; ModelTransform: 1307.084,228.346,0,0,0,0,0,0,-15.748; Pitch: 0.5mm; Current Rating: 500mA; Supplementary Features: 带柱; Symbol: LB3524-G120S-W0R; Device: LB3524-G120S-W0R; LCSC Part Name: PIN:120P 间距:0.5mm 立贴; SupplierPart: C52269554; ManufacturerPart: LB3524-G120S-W0R; Supplier Footprint: SMD,P=0.5mm; JLCPCB Part Class: Extended Part; Datasheet: https://item.szlcsc.com/datasheet/LB3524-G120S-W0R/55135398.html; Supplier: LCSC; ConvertToPcb: yes; FootprintName: CONN-SMD_LB3524-G120S-W0R; Number of Pins: 120P; Mounting Type: 立贴; Number of Rows: 2
R1 R3 R4 R6 = Res2: Resistor; 编号: 110101501165X; 名称: 贴片电阻Chip Res. 0603 4.7KΩ 1/10W 士1%(RoHS)
R2 = Res2: Resistor; 编号: 110101501023X; 名称: 贴片电阻Chip Res.0603 33Ω  1/16W 土1% 旧编码11279109(RoHS)
R5 = 510R 1% 0603: 贴片电阻
R7 = 5.1K 1% 0603: 贴片电阻; 编号: 110101500689X; 名称: 贴片电阻Chip Res. 0603 5.1KΩ 1/10W 士1% 旧编码11277020(RoHS)
R8 R9 = Res2: Resistor; 编号: 110101500688X; 名称: 贴片电阻Chip Res. 0603 2.2KΩ  1/10W 士1% 旧编码11277019(RoHS)
R10-R18 R20 R22 = R_0603: 贴片电阻_0603封装
SW1 SW2 = SW-PB: 微动开关_按键
U1 U3 = w25q64: 编号: 110100201352X; 名称: (CD)IC FPGA配置芯片 W25Q64JVSSIQ 封装 SO-8 208mil "Winbond"牌(RoHS)
U2 = W9825G6KH: 编号: 110100201923X; 名称: (CD)IC/贴片/同步动态随机存取器SDRAM/W9825G6KH-6/TSOPII-54/"Winbond"牌/4M*4banks*16bits
U4 = FM24CL04: 2ECL; 编号: 110100201653X; 名称: (CD)IC/贴片/铁电存储器/FM24CL64B-GTR/SOIC-8/CYPRESS
U5 = TPS564201DDCR: C464812; Manufacturer: TI(德州仪器); AddInBom: yes; ModelId: 18da8f6c14a34920b3e136b5c401a119; ModelName: SOT-23-6_L2.9-W1.6-H1.5-LS2.8-P0.95; ModelTransform: 110.236,113.364,0,90,0,0,0.0005,0.0005,0; Function: 降压型; Output Type: 可调; Voltage - Supply: 4.5V~17V; Output Voltage: 760mV~7V; Output Current: 4A; Frequency - Switching: 560kHz; Synchronous Rectifier: 是; Number of Outputs: 1; Topology: 降压式; Switch tube (built-in/external): 内置; Symbol: TPS564201DDCR; Device: TPS564201DDCR; LCSC Part Name: 4.5V至17V输入，4A同步降压电压调节器; SupplierPart: C464812; ManufacturerPart: TPS564201DDCR; Supplier Footprint: TSOT-23-6; JLCPCB Part Class: Extended Part; Datasheet: https://www.ti.com/cn/lit/gpn/tps564201; Supplier: LCSC; ConvertToPcb: yes; FootprintName: SOT-23-6_L2.9-W1.6-P0.95-LS2.8-BL; Operating Temperature: -40℃~+125℃@(TJ); Quiescent Current: -
U6 = STM32H750IBK6TR: 42.74; Manufacturer: ST(意法半导体); Add into BOM: yes; CPU Core: ARM-M系列; GPIO Ports Number: 140; Operating Voltage Range: 1.62V~3.6V; CPU Maximum Speed: 480MHz; ADC (Bit): 16bit; DAC (Bit): 12bit; Universal Serial Bus: 有; Symbol: STM32H750IBK6TR; Device: STM32H750IBK6TR; LCSC Part Name: STM32H750IBK6TR; Supplier Part: C5762514; Manufacturer Part: STM32H750IBK6TR; Supplier Footprint: UFBGA-201; JLCPCB Part Class: 扩展库; Supplier: LCSC; Convert to PCB: yes; Operating Temperature Range: -40℃~+85℃; Secure Digital Input and Output: 有; Direct Memory Access: 有
U7 = REF3030/3040AIDCKT: 基准源芯片_输出稳定3.0V
U8 = TPD2E001DRLR_瞬态抑制二极管: 1.1439; Manufacturer: TI(德州仪器); Add into BOM: yes; polarity: 单向; Reverse Stand-Off Voltage (Vrwm): 5.5V@Max; Breakdown Voltage: 11V; Symbol: TPD2E001DRLR; Device: TPD2E001DRLR; LCSC Part Name: TPD2E001DRLR; Supplier Part: C150526; Manufacturer Part: TPD2E001DRLR; Supplier Footprint: SOT-553-5; JLCPCB Part Class: 扩展库; Datasheet: https://www.ti.com/cn/lit/gpn/tpd2e001; Supplier: LCSC; Convert to PCB: yes; Maximum Clamping Voltage: -; Peak Pulse Current (Ipp)@10/1000us: -; Peak Pulse Power Dissipation (Ppp)@10/1000us: -; Type: TVS
U9 = SGM809: 1.6911; Co.Number: 110100200384
X1 = XKXGI-SUA-32.768K: 晶振类型:贴片晶振;频率:32.768kHz;常温频差:±20ppm;负载电容:12.5pF;频率稳定度:±30ppm;; Manufacturer: YXC(扬兴晶振); AddInBom: yes; ModelId: 762d7afc596f4558a373612390f4386d聨0819f05c4eef4c71ace90d822a990e87; ModelName: CRYSTAL-SMD_L3.2-W1.5-1; ModelTransform: 125.984,59.055,0,0,0,0,0,0,0; Normal temperature Frequency Tolerance: ±20ppm; Load Capacitance: 12.5pF; Frequency Stability: ±30ppm; Symbol: XKXGI-SUA-32.768K; Device: XKXGI-SUA-32.768K; LCSC Part Name: YST310S 32.768KHZ 2P 3215 12.5PF ±20PPM -40~85℃; SupplierPart: C5213671; ManufacturerPart: XKXGI-SUA-32.768K; Supplier Footprint: SMD3215-2P; JLCPCB Part Class: Extended Part; Datasheet: https://item.szlcsc.com/datasheet/XKXGI-SUA-32.768K/5908943.html; Supplier: LCSC; ConvertToPcb: yes; FootprintName: CRYSTAL-SMD_L3.2-W1.5-1; Type: 贴片晶振; Value: 32.768kHz; Operating Temperature: -40℃~+85℃
Y1 = 25M: 1.7366